# EAGLE design control (EAGLE 6.4)
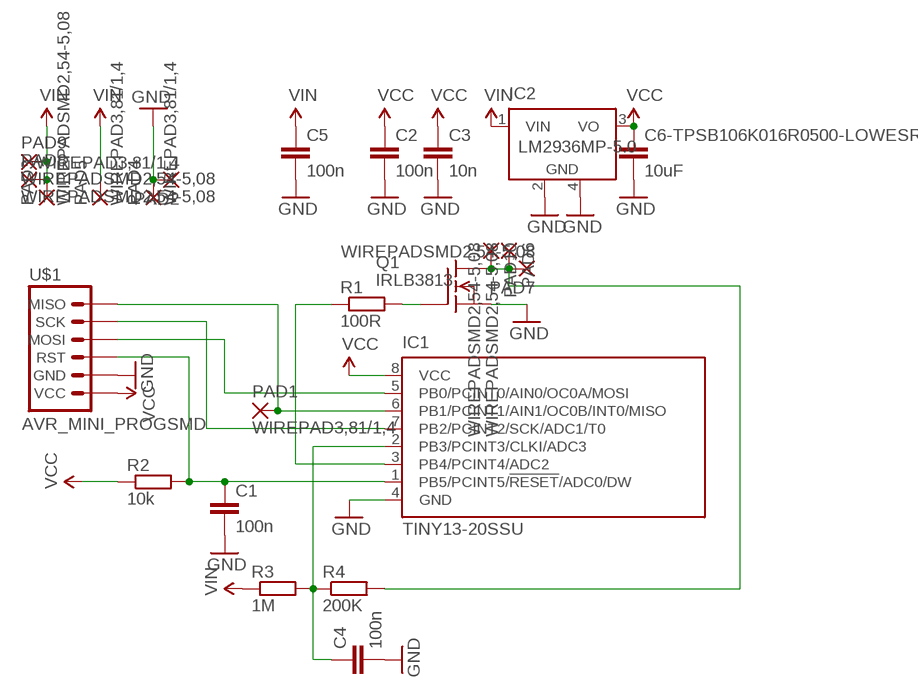
[diagram p0: schematic, sheet 1]

## Parts
C1  100n  CAP1210  [1210]
C2  100n  CAP1206  [1206]
C3  10n  CAP1206  [1206]
C4  100n  CAP1206  [1206]
C5  100n  CAP1206  [1206]
C6-TPSB106K016R0500-LOWESR  10uF  C-EUC1210  [C1210]
IC1  TINY13-20SSU  [8S1]
IC2  LM2936MP-5.0  [SOT223]
PAD1  WIREPAD3,81/1,4  [3,81/1,4]
PAD2  WIREPAD3,81/1,4  [3,81/1,4]
PAD3  WIREPADSMD2,54-5,08  [SMD2,54-5,08]
PAD4  WIREPAD3,81/1,4  [3,81/1,4]
PAD5  WIREPAD3,81/1,4  [3,81/1,4]
PAD6  WIREPADSMD2,54-5,08  [SMD2,54-5,08]
PAD7  WIREPADSMD2,54-5,08  [SMD2,54-5,08]
PAD8  WIREPADSMD2,54-5,08  [SMD2,54-5,08]
PAD9  WIREPADSMD2,54-5,08  [SMD2,54-5,08]
PAD10  WIREPADSMD2,54-5,08  [SMD2,54-5,08]
Q1  IRLB3813  IRF540  [TO220]
R1  100R  R-EU_M1206  [M1206]
R2  10k  R-EU_R1206  [R1206]
R3  1M  R-EU_M1206  [M1206]
R4  200K  R-EU_M1206  [M1206]
U$1  AVR_MINI_PROGSMD  [AVR_MINI_PROG]

## Nets
GND: C1.2 C2.2 C3.2 C4.2 C5.2 C6-TPSB106K016R0500-LOWESR.2 IC1.4(GND) IC2.2(GND) IC2.4(GND) PAD2.1(P) PAD4.1(P) Q1.3(S) U$1.2(GND)
N$1: IC1.6(PB1/PCINT1/AIN1/OC0B/INT0/MISO) PAD1.1(P) U$1.6(MISO)
N$2: IC1.5(PB0/PCINT0/AIN0/OC0A/MOSI) U$1.4(MOSI)
N$3: IC1.7(PB2/PCINT2/SCK/ADC1/T0) U$1.5(SCK)
N$4: C1.1 IC1.1(PB5/PCINT5/!RESET!/ADC0/DW) R2.2 U$1.3(RST)
N$5: Q1.1(G) R1.2
N$6: IC1.3(PB4/PCINT4/ADC2) R1.1
N$7: PAD6.1(P) PAD7.1(P) PAD10.1(P) Q1.2(D) R4.2
N$8: C4.1 IC1.2(PB3/PCINT3/CLKI/ADC3) R3.2 R4.1
VCC: C2.1 C3.1 C6-TPSB106K016R0500-LOWESR.1 IC1.8(VCC) IC2.3(VO) R2.1 U$1.1(VCC)
VIN: C5.1 IC2.1(VIN) PAD3.1(P) PAD5.1(P) PAD8.1(P) PAD9.1(P) R3.1

## Library data of the parts
C1-C5 = SparkFun-Passives:CAP: Capacitor Standard 0603 ceramic capacitor, and 0.1" leaded capacitor.
C6-TPSB106K016R0500-LOWESR = resistor:C-EU: CAPACITOR, European symbol
IC1 = atmel:TINY13: 8-bit AVR Microcontroller with 1K Bytes In-System Programmable Flash Source: http://www.atmel.com/dyn/resources/prod_documents/2535S.pdf; MPN: ATTINY13-20SSU; OC_FARNELL: 1455133; OC_NEWARK: 58M3771
IC2 = national-semiconductor:LM2936MP?*: Ultra-Low Quiescent Current LDO Voltage Regulator Source: Data sheet <http://www.national.com/ds/LM/LM2936.pdf>; MF: NATIONAL SEMICONDUCTOR; MPN: LM2936MP-5.0/NOPB; OC_FARNELL: 1469063; OC_NEWARK: 41K4524
PAD1-PAD10 = wirepad:WIREPAD: Wire PAD connect wire on PCB
Q1 = transistor-fet:IRF540: N-Channel Enhancement MOSFET (HEXFET); 100V; 28A; 0,077Ohm
R1-R4 = rcl:R-EU_: RESISTOR, European symbol
U$1 = SparkFun-Connectors:AVR_MINI_PROG: AVR ISP 6-pin inline header

## Board
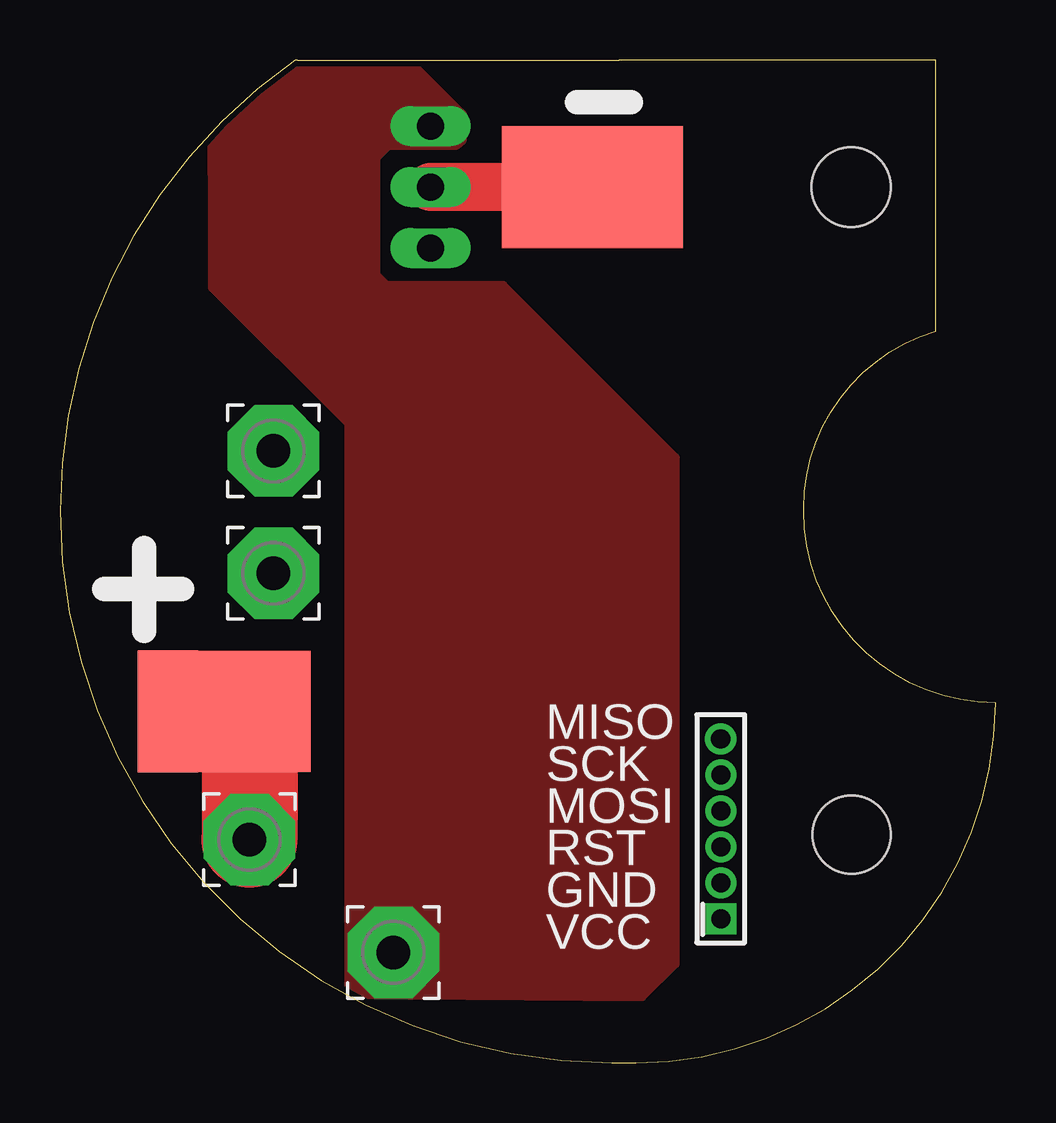
[diagram p1: board, top side]
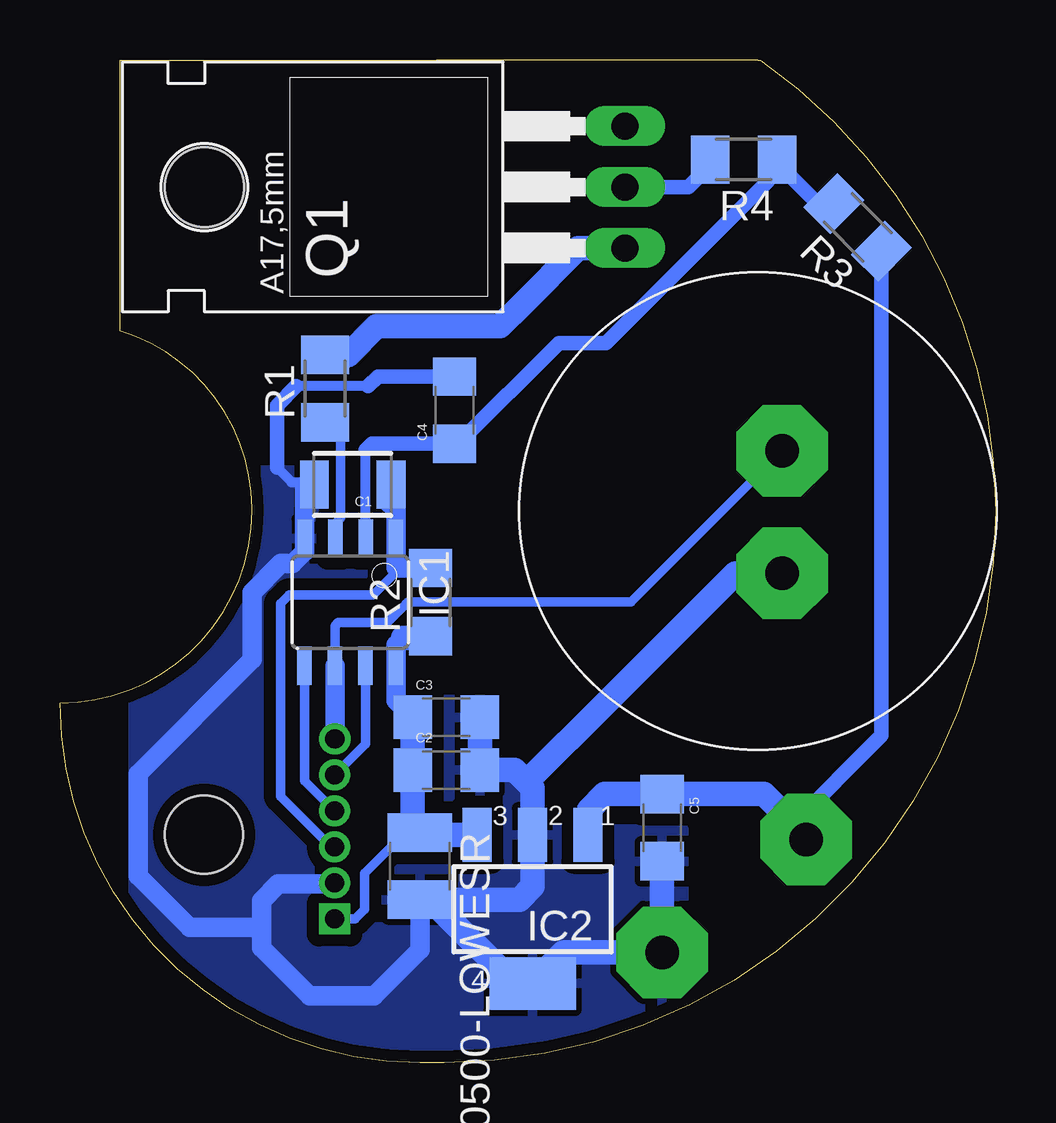
[diagram p2: board, bottom side, seen from below]

Size 39 x 41.8 mm. Coordinates in mm from the lower left corner, seen from the top.
Outline: 0,23 arc90 23,0 24,0 arc90 39,15 arc-90 31,23 31,23.1 arc-73 36.5,30.5 36.5,41.8 23.3,41.8 9.9,41.8 9.8,41.8 arc55 0,23
Copper layers (1*16): Top 0.035mm / dielectric 1.5mm / Bottom 0.035mm
Design rules "Fusion_eagle_rule_v1.1": minimum track width 6mil, minimum drill 12mil, track to track 6mil, track to pad 6mil, pad to pad 6mil, via to via 6mil, smd to smd 0mil, copper to edge 10mil, drill to drill 10mil, minimum pad ring 10mil, minimum via ring 6mil, stop-mask expansion 2mil, vias tented up to drill 100mil, thermal gap 10mil
Holes 3.25 mm at 33,9.5

### Footprints (pad centres in the part's own frame; a part is rotated, then mirrored left to right if it is on the bottom)
1210 = smd 1.2 x 2: 1 -1.6,0; 2 1.6,0
1206 = smd 1.6 x 1.8: 1 -1.4,0; 2 1.4,0
C1210 = smd 1.6 x 2.7: 1 -1.4,0; 2 1.4,0
8S1 = smd 0.6 x 1.6: 1 -1.905,-2.654; 2 -0.645,-2.654; 3 0.625,-2.654; 4 1.895,-2.654; 5 1.905,2.654; 6 0.635,2.654; 7 -0.635,2.654; 8 -1.905,2.654
SOT223 = smd 1.219 x 2.235: 1 -2.311,-3.099; 2 0,-3.099; 3 2.311,-3.099 | smd 3.6 x 2.2: 4 0,3.099
3,81/1,4 = drill 1.397 pad 3.81 octagon: 1 0,0
SMD2,54-5,08 = smd 2.54 x 5.08: 1 0,0
TO220 = drill 1.118 long: 1 -2.54,-6.35; 2 0,-6.35; 3 2.54,-6.35 | hole 3.302: 0,11.176
M1206 = smd 1.6 x 2: 1 -1.4,0; 2 1.4,0
R1206 = smd 1.6 x 1.803: 1 -1.422,0; 2 1.422,0
AVR_MINI_PROG = drill 0.8 pad 1.27 square: 1 0,0 | drill 0.8 pad 1.27: 2 1.5,0; 3 3,0; 4 4.5,0; 5 6,0; 6 7.5,0.01

### Placement (x,y rotation side)
C1  26.8,24.1 180 bottom
C2  22.9,12.2 0 bottom
C3  22.9,14.4 0 bottom
C4  22.55,27.2 90 bottom
C5  13.9,9.8 270 bottom
C6-TPSB106K016R0500-LOWESR  24,8.2 270 bottom
IC1  26.9,19.2 180 bottom
IC2  19.3,6.4 180 bottom
PAD1  8.9,25.5 0 top
PAD2  8.9,20.4 0 top
PAD3  7.9,13.4 90 top
PAD4  13.9,4.6 0 top
PAD5  7.9,9.3 0 top
PAD6  22.2,36.5 0 top
PAD7  19.7,36.5 0 top
PAD8  7.9,15.9 90 top
PAD9  4.5,14.65 0 top
PAD10  24.7,36.5 0 top
Q1  21.8,36.5 90 bottom
R1  27.95,28.1 90 bottom
R2  23.55,19.2 90 bottom
R3  5.74,34.82 135 bottom
R4  10.5,37.65 180 bottom
U$1  27.55,6 90 top

### Tracks (layer width: path | path; a pad name or v marks a point on that pad's centre or on a via)
GND
  Bottom 0.4: C6-TPSB106K016R0500-LOWESR.2 23.55,6.8 | 20,3.25 19.35,3.25 IC2.4 | 28.8,24 C1.2
  Bottom 0.406: 21,14.9 C3.2 | 16.15,14.75 16.12,15.12 | 26.15,28.2 29.15,28.2 | 29.95,24.8 29.35,24.2 28.5,24.2 C1.2
  Bottom 0.61: C4.2 25.75,28.6 26.15,28.2 | 29.15,28.2 29.95,27.4 29.95,24.8
  Bottom 0.813: 28.8,24 IC1.4 28.8,21.3 29.3,20.8 29.8,20.8 31,19.6 31,16.8 35.75,12.05 35.75,7.8 33.6,5.65 30.75,5.65 30.6,5.5 | C6-TPSB106K016R0500-LOWESR.2 24,4.7 25.9,2.8 28.6,2.8 30.6,4.8 30.6,5.5 | 30.6,5.5 30.6,6.75 29.9,7.45 27.6,7.45 U$1.2
  Bottom 1.016: IC2.4 18,4.6 PAD4.1 C5.2 | 20,3.25 23.55,6.8 19.85,6.8 19.3,7.35 IC2.2 19.3,11.45 19.55,11.7 | C3.2 C2.2 20.05,12.2 19.55,11.7 | PAD2.1 10.85,20.4 16.12,15.12 19.55,11.7
  pour Bottom (isolate 0.5): 13,0 35.95,-0.1 35.95,24.7 28.05,24.73 25.4,24.8 25.4,15.15 21.05,15.15 21.05,12.15 19.85,12.15 19.85,11.4 19.4,11.4 19.4,9.75 13,9.75
  pour Top (no thermals): 12.05,2.85 24.24,2.75 25.64,4.12 25.64,25.23 18.46,32.4 13.61,32.4 13.15,32.86 13.15,37.7 13.7,38.25 16.5,38.25 16.75,38.45 16.75,39.55 14.6,41.7 13.15,41.7 6.35,41.67 6.36,32.32 12.05,26.65
N$1
  Bottom 0.4: 27.54,13.55 U$1.6 | IC1.6 27.54,18.21 27.4,18.35 25.35,18.35 24.6,19.1 24.55,19.15 24.5,19.2 15.2,19.2 PAD1.1
  Bottom 0.813: IC1.6 27.54,13.55
N$2
  Bottom 0.4: IC1.5 28.8,11.76 U$1.4
N$3
  Bottom 0.4: IC1.7 26.27,13.29 U$1.5
N$4
  Bottom 0.4: U$1.3 27.7,9 29.8,11.1 29.8,19.15 29.45,19.5 25.95,19.5 25,20.45 25,20.65 24.97,20.62 | IC1.1 | C1.1 25.4,23.45
  Bottom 0.813: 25,20.65 IC1.1 | R2.2 24.97,20.62 | 25.4,23.45 25,23.05 IC1.1
N$5
  Bottom 0.4: R1.2 27,29.5 | Q1.1
  Bottom 1.016: 27,29.5 25.8,30.7 20.65,30.7 19.75,31.6 17.4,33.95 Q1.1
N$6
  Bottom 0.4: IC1.3 27.52,22.48 27.3,22.7 27.3,26.35 R1.1
N$7
  Top 0.4: PAD10.1 PAD7.1
  Top 2: PAD6.1 PAD7.1 Q1.2
  Bottom 0.406: R4.2 11.8,37.5
  Bottom 0.61: 11.8,37.5 12.8,36.5 Q1.2
N$8
  Bottom 0.406: IC1.2 26.25,25.55 | C4.1 22.4,25.8 | 9.5,36.75 9.5,37.15 R4.1 9,37.4 | 7.3,35.7 6.84,35.7 R3.2
  Bottom 0.61: 26.25,25.55 26,25.8 C4.1 | 22.4,25.8 18.2,30 16.25,30 9.5,36.75 | 9,37.4 7.3,35.7
VCC
  Bottom 0.4: U$1.1 26.7,6 26.3,6.4 26.3,7.9 24.65,9.55 24.05,9.55 C6-TPSB106K016R0500-LOWESR.1 | 24.3,9.9 C6-TPSB106K016R0500-LOWESR.1 | 23.9,9.5 C6-TPSB106K016R0500-LOWESR.1 | 23.28,17.7 R2.1
  Bottom 0.813: C3.1 25,15.1 IC1.8 25,17.41 24.7,17.7
  Bottom 1.016: C3.1 C2.1 24.3,9.9 | IC2.3 23.9,9.5 | 24.7,17.7 23.28,17.7
VIN
  Top 0.4: PAD8.1 PAD3.1 PAD8.1 | PAD8.1 5.75,15.9 PAD9.1
  Top 4: PAD3.1 PAD5.1
  Bottom 0.4: 16.95,10.55 16.95,9.54 IC2.1 | 8.95,10.5 8.95,10.35
  Bottom 0.61: R3.1 4.75,13.65 8.5,9.9
  Bottom 1.016: 16.95,10.55 16.3,11.2 C5.1 9.65,11.2 8.95,10.5 | 8.95,10.35 8.5,9.9 PAD5.1

### Text on the board
tPlace: MISO | SCK | MOSI | RST | GND | VCC